# EAGLE design CajitaAbierta (EAGLE 9.6.2)
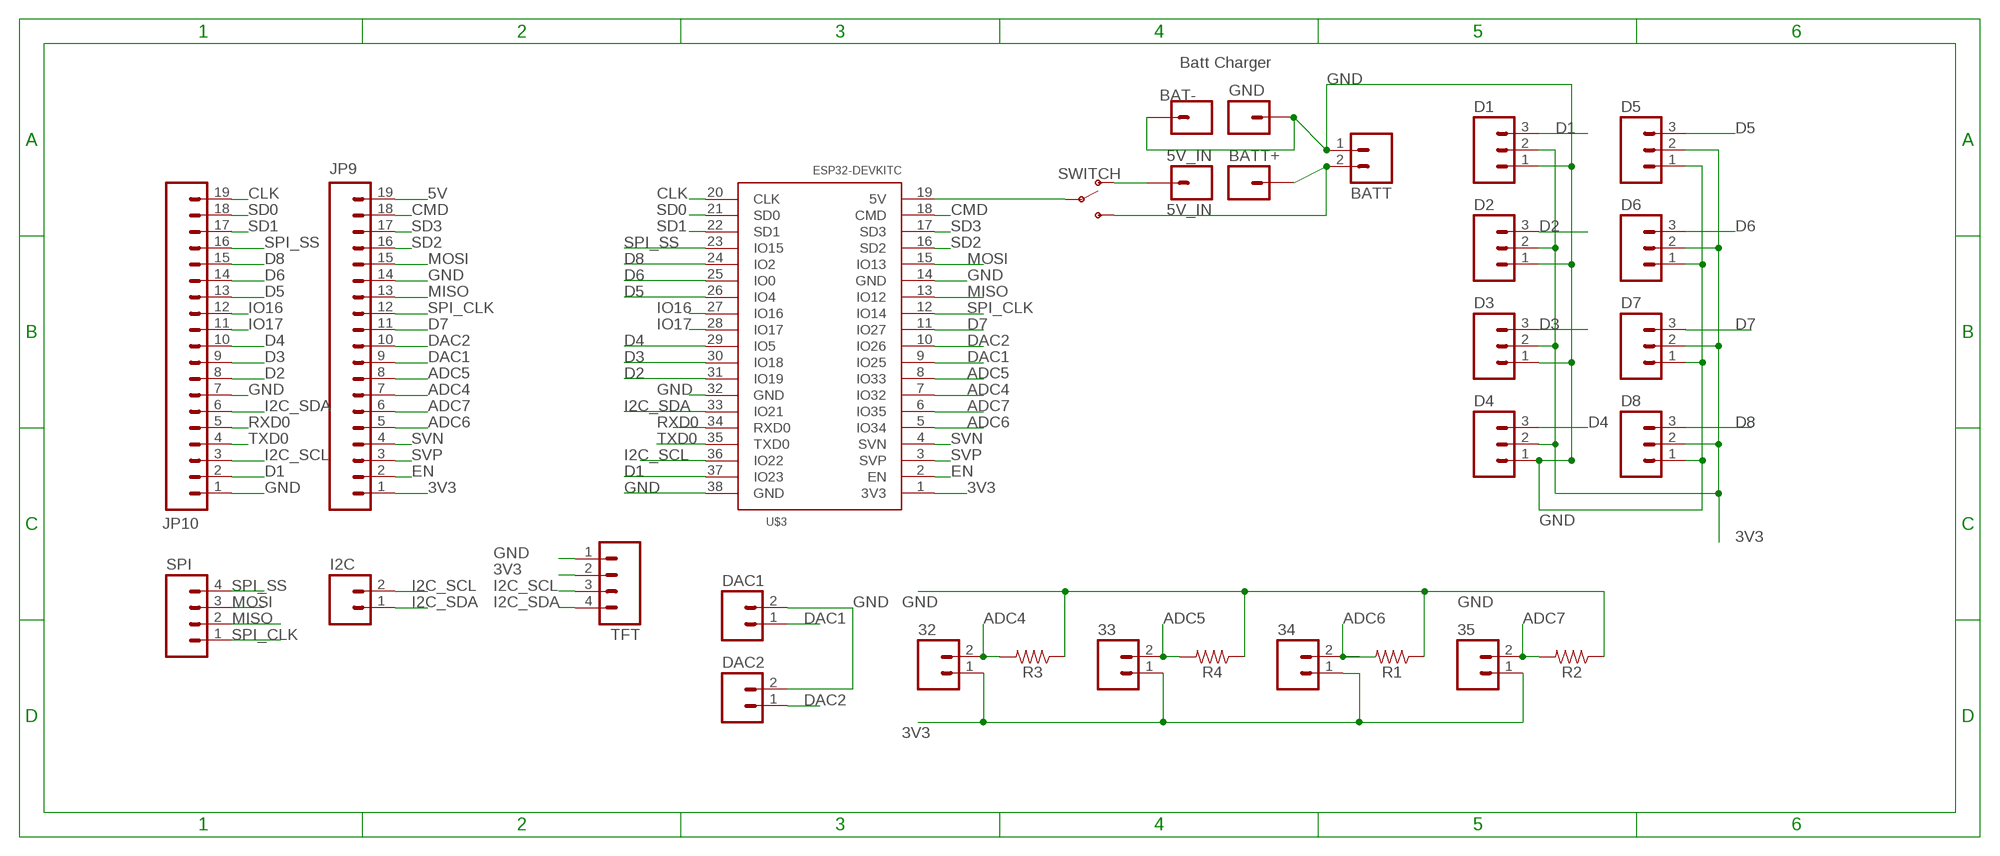
[diagram p0: schematic, sheet 1]

## Parts
5V_IN  5V_IN  M01PTH  [1X01]
32  M02PTH  [1X02]
33  M02PTH  [1X02]
34  M02PTH  [1X02]
35  M02PTH  [1X02]
BAT-  M01PTH  [1X01]
BATT  M02LOCK_LONGPADS  [1X02_LOCK_LONGPADS]
BATT+  M01PTH  [1X01]
D1  M03LOCK_LONGPADS  [1X03_LOCK_LONGPADS]
D2  M03LOCK_LONGPADS  [1X03_LOCK_LONGPADS]
D3  M03LOCK_LONGPADS  [1X03_LOCK_LONGPADS]
D4  M03LOCK_LONGPADS  [1X03_LOCK_LONGPADS]
D5  M03LOCK_LONGPADS  [1X03_LOCK_LONGPADS]
D6  M03LOCK_LONGPADS  [1X03_LOCK_LONGPADS]
D7  M03LOCK_LONGPADS  [1X03_LOCK_LONGPADS]
D8  M03LOCK_LONGPADS  [1X03_LOCK_LONGPADS]
DAC1  M02PTH  [1X02]
DAC2  M02PTH  [1X02]
GND  Batt Charger  M01PTH  [1X01]
I2C  M02PTH  [1X02]
JP9  M191X19  [1X19]
JP10  M191X19  [1X19]
R1  RESISTOR1206  [1206]
R2  RESISTOR1206  [1206]
R3  RESISTOR1206  [1206]
R4  RESISTOR1206  [1206]
SPI  M04PTH  [1X04]
SWITCH  SWITCH-SPDT-SMD-RIGHT-ANGLE  [SWITCH_SPST_SMD_A]
TFT  M04PTH  [1X04]
U$3  ESP32DEVKITC  [ESP32-DEVKITC]

## Nets
3V3: 32.1 33.1 34.1 35.1 D1.2 D2.2 D3.2 D4.2 D5.2 D6.2 D7.2 D8.2 JP9.1 TFT.2 U$3.1(3V3)
5V: JP9.19 SWITCH.2(P) U$3.19(5V)
5V_IN: 5V_IN.1 SWITCH.1(O)
ADC4: 32.2 JP9.7 R3.2 U$3.7(IO32)
ADC5: 33.2 JP9.8 R4.2 U$3.8(IO33)
ADC6: 34.2 JP9.5 R1.2 U$3.5(IO34)
ADC7: 35.2 JP9.6 R2.2 U$3.6(IO35)
BATT+: BATT+.1 BATT.2 SWITCH.3(S)
CLK: JP10.19 U$3.20(CLK)
CMD: JP9.18 U$3.18(CMD)
D1: D1.3 JP10.2 U$3.37(IO23)
D2: D2.3 JP10.8 U$3.31(IO19)
D3: D3.3 JP10.9 U$3.30(IO18)
D4: D4.3 JP10.10 U$3.29(IO5)
D5: D5.3 JP10.13 U$3.26(IO4)
D6: D6.3 JP10.14 U$3.25(IO0)
D7: D7.3 JP9.11 U$3.11(IO27)
D8: D8.3 JP10.15 U$3.24(IO2)
DAC1: DAC1.1 JP9.9 U$3.9(IO25)
DAC2: DAC2.1 JP9.10 U$3.10(IO26)
EN: JP9.2 U$3.2(EN)
GND: BAT-.1 BATT.1 D1.1 D2.1 D3.1 D4.1 D5.1 D6.1 D7.1 D8.1 DAC1.2 DAC2.2 GND.1 JP9.14 JP10.1 JP10.7 R1.1 R2.1 R3.1 R4.1 TFT.1 U$3.14(GND) U$3.32(GND) U$3.38(GND)
I2C_SCL: I2C.2 JP10.3 TFT.3 U$3.36(IO22)
I2C_SDA: I2C.1 JP10.6 TFT.4 U$3.33(IO21)
IO16: JP10.12 U$3.27(IO16)
IO17: JP10.11 U$3.28(IO17)
MISO: JP9.13 SPI.2 U$3.13(IO12)
MOSI: JP9.15 SPI.3 U$3.15(IO13)
RXD0: JP10.5 U$3.34(RXD0)
SD0: JP10.18 U$3.21(SD0)
SD1: JP10.17 U$3.22(SD1)
SD2: JP9.16 U$3.16(SD2)
SD3: JP9.17 U$3.17(SD3)
SPI_CLK: JP9.12 SPI.1 U$3.12(IO14)
SPI_SS: JP10.16 SPI.4 U$3.23(IO15)
SVN: JP9.4 U$3.4(SVN)
SVP: JP9.3 U$3.3(SVP)
TXD0: JP10.4 U$3.35(TXD0)

## Library data of the parts
5V_IN BAT- BATT+ GND = SparkFun-Connectors:M01: Header 1 Standard 1-pin 0.1" header. Use with straight break away headers (SKU : PRT-00116), right angle break away headers (PRT-00553), swiss pins (PRT-00743), machine pins (PRT-00117), and female headers (PRT-00115).
32-35 BATT DAC1 DAC2 I2C = SparkFun-Connectors:M02: Standard 2-pin 0.1" header. Use with - straight break away headers ( PRT-00116) - right angle break away headers (PRT-00553) - swiss pins (PRT-00743) - machine pins (PRT-00117) - female headers (PRT-00115) Molex polarized connector foot print use with: PRT-08233 with associated crimp pins and housings. 2.54_SCREWTERM for use with PRT-10571. 3.5mm Screw Terminal footprints for PRT-08084 5mm Screw Terminal footprints for use with PRT-08432
D1-D8 = SparkFun-Connectors:M03: Header 3 Standard 3-pin 0.1" header. Use with straight break away headers (SKU : PRT-00116), right angle break away headers (PRT-00553), swiss pins (PRT-00743), machine pins (PRT-00117), and female headers (PRT-00115). Molex polarized connector foot print use with SKU : PRT-08232 with associated crimp pins and housings.
JP9 JP10 = SparkFun-Connectors:M19: 1x19 .1" header
R1-R4 = SparkFun-Resistors:RESISTOR: Generic Resistor Package
SPI TFT = SparkFun-Connectors:M04: Header 4 Standard 4-pin 0.1" header. Use with straight break away headers (SKU : PRT-00116), right angle break away headers (PRT-00553), swiss pins (PRT-00743), machine pins (PRT-00117), and female headers (PRT-00115). Molex polarized connector foot print use with SKU : PRT-08231 with associated crimp pins and housings. 1MM SMD Version SKU: PRT-10208
SWITCH = SparkFun-Switches:SWITCH-SPDT: Single Pole, Double Throw (SPDT) Switch Single-pole, double-throw (SPDT) switch. Variant Overview SMD-AYZ0202 Surface Mount DPDT Switch <https://www.sparkfun.com/products/597> (COM-00597) Used on e.g. LilyPad Arduino USB - ATmega32U4 Board <https://www.sparkfun.com/products/12049> PTH-11.6X4.0MM SPDT Mini Power Switch <https://www.sparkfun.com/products/102> (COM-00102) Used on e.g. SparkFun Simon Says - Through-Hole Soldering Kit <https://www.sparkfun.com/products/10547> (KIT-10547) PTH-11.6X4.0MM-KIT KIT version of SPDT Mini Power Switch - Simplifies soldering by removing tStop of switch pins - only one side can be soldered. PTH-11.6X4.0MM-LOCK LOCK version of SPDT Mini Power Switch - Offset pins hold switch in place for easier soldering. SMD-RIGHT-ANGLE Surface Mount Right Angle Switch <https://www.sparkfun.com/products/10860> (COM-10860) Used on e.g. SparkFun ESP8266 Thing <https://www.sparkfun.com/products/13231>; PROD_ID: SWCH-10651; SF_SKU: COM-10860
U$3 = ESP32-DEVKITC:ESP32DEVKITC

## Board
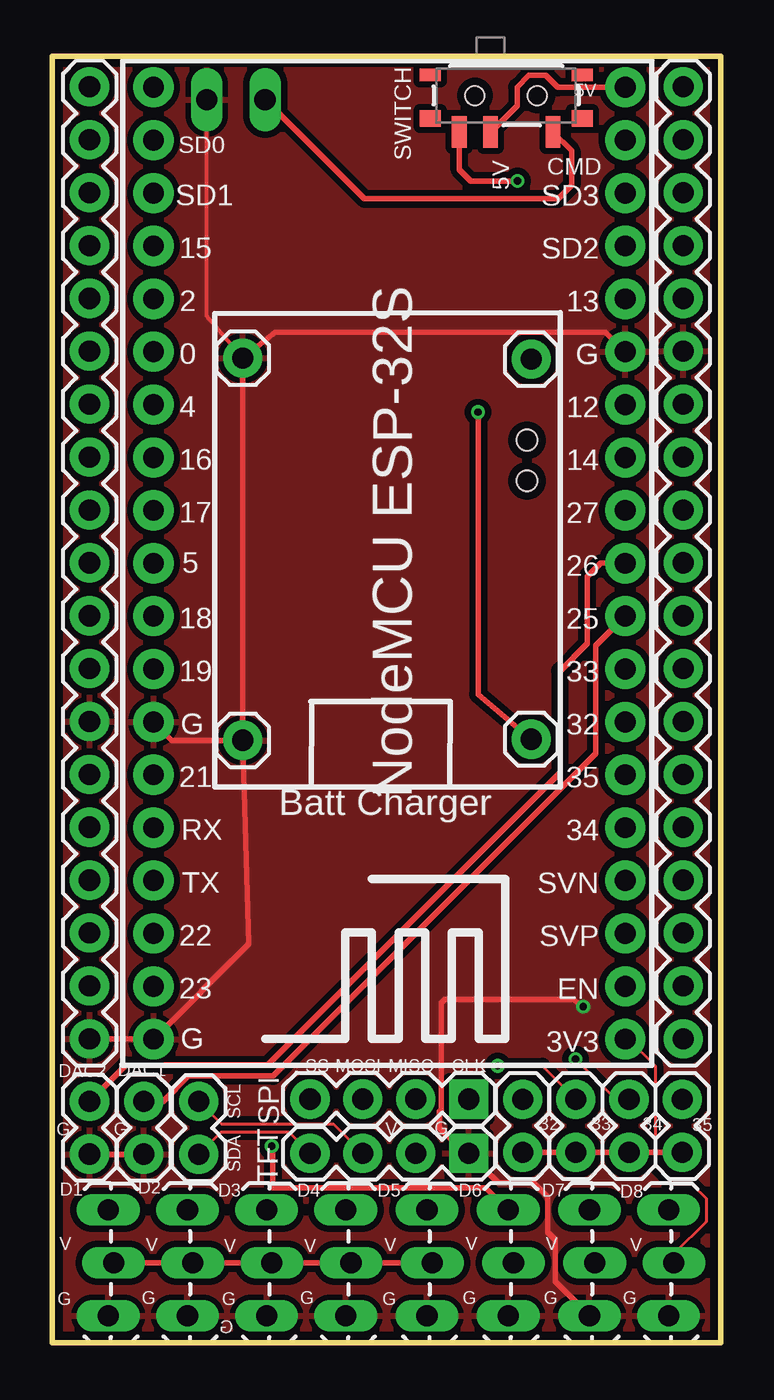
[diagram p1: board, top side]
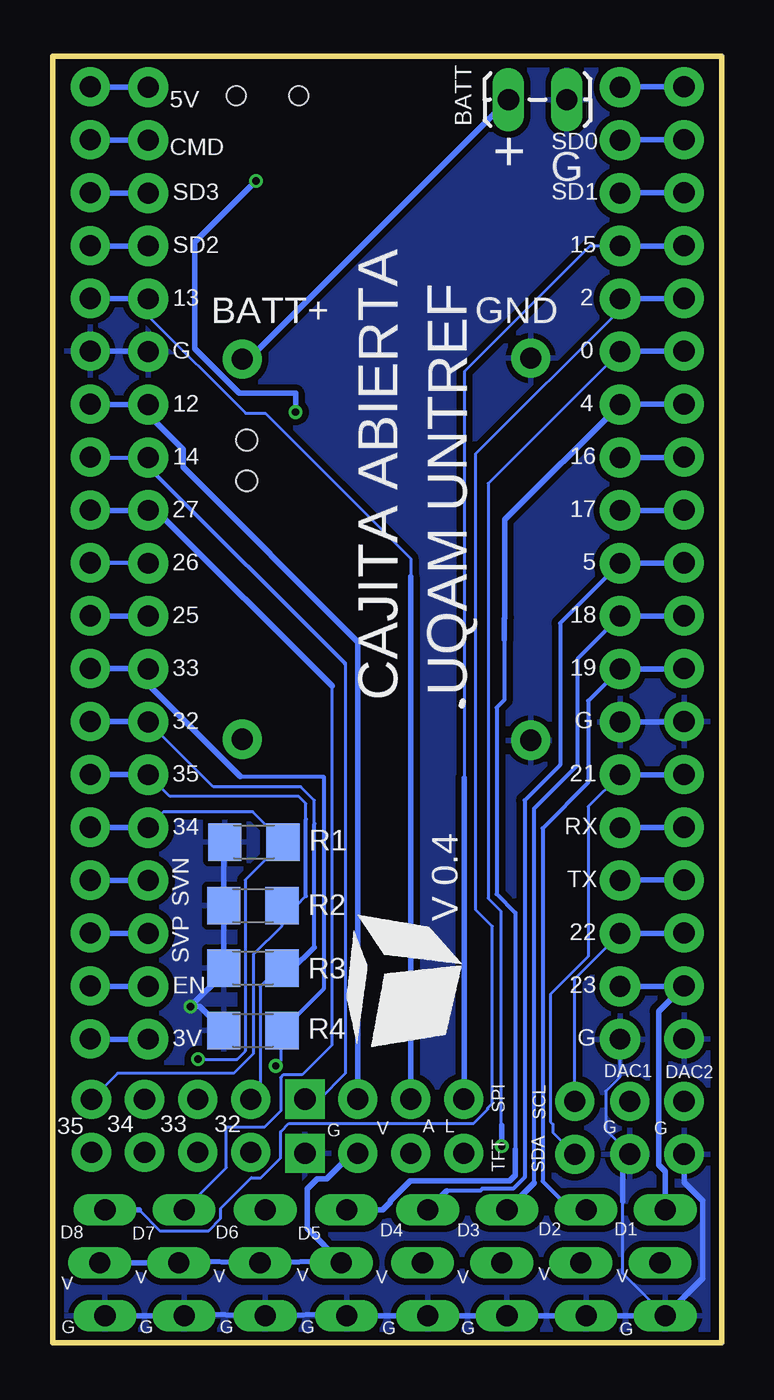
[diagram p2: board, bottom side, seen from below]

Size 32.1 x 61.8 mm. Coordinates in mm from the lower left corner, seen from the top.
Outline: 32.1,61.8 32.1,0 0,0 0,61.8 32.1,61.8
Copper layers (1*16): Top 0.035mm / dielectric 1.5mm / Bottom 0.035mm
Design rules "NOA Eagle Rule 2016-06-12": minimum track width 6mil, minimum drill 0.3mm, track to track 6mil, track to pad 6mil, pad to pad 6mil, via to via 6mil, smd to smd 0mil, copper to edge 0.4mm, drill to drill 10mil, minimum pad ring 10mil, minimum via ring 6mil, stop-mask expansion 2mil, vias tented up to drill 25mil, thermal gap 10mil
Holes 1 mm at 22.8,43.35 22.8,41.4

### Footprints (pad centres in the part's own frame; a part is rotated, then mirrored left to right if it is on the bottom)
1X01 = drill 1.016 pad 1.88: 1 0,0
1X02 = drill 1.016 pad 1.88: 1 0,0; 2 2.54,0
1X02_LOCK_LONGPADS = drill 1.016 long: 1 -0.127,0; 2 2.667,0
1X03_LOCK_LONGPADS = drill 1.016 long: 1 0,0; 2 2.54,-0.254; 3 5.08,0
1X19 = drill 1.016 pad 1.88: 1 0,0; 2 2.54,0; 3 5.08,0; 4 7.62,0; 5 10.16,0; 6 12.7,0; 7 15.24,0; 8 17.78,0; 9 20.32,0; 10 22.86,0; 11 25.4,0; 12 27.94,0; 13 30.48,0; 14 33.02,0; 15 35.56,0; 16 38.1,0; 17 40.64,0; 18 43.18,0; 19 45.72,0
1206 = smd 1.6 x 1.8: 1 -1.4,0; 2 1.4,0
1X04 = drill 1.016 pad 1.88 square: 1 0,0 | drill 1.016 pad 1.88: 2 2.54,0; 3 5.08,0; 4 7.62,0
SWITCH_SPST_SMD_A = smd 0.7 x 1.5: 1 -2.25,-1.75; 2 -0.75,-1.75; 3 2.25,-1.75 | smd 1 x 0.6: GND1 -3.65,1; GND3 3.65,1 | smd 1 x 0.8: GND2 -3.65,-1.1; GND4 3.65,-1.1 | hole 0.9: -1.5,0; 1.5,0
ESP32-DEVKITC = drill 1 pad 1.93: 1 -22.87,-11.42; 2 -20.33,-11.42; 3 -17.79,-11.42; 4 -15.25,-11.42; 5 -12.71,-11.42; 6 -10.17,-11.42; 7 -7.63,-11.42; 8 -5.09,-11.42; 9 -2.55,-11.42; 10 -0.01,-11.42; 11 2.53,-11.42; 12 5.07,-11.42; 13 7.61,-11.42; 14 10.15,-11.42; 15 12.69,-11.42; 16 15.23,-11.42; 17 17.77,-11.42; 18 20.31,-11.42; 19 22.85,-11.42; 20 22.85,11.23; 21 20.31,11.23; 22 17.77,11.23; 23 15.23,11.23; 24 12.69,11.23; 25 10.15,11.23; 26 7.61,11.23; 27 5.07,11.23; 28 2.53,11.23; 29 -0.01,11.23; 30 -2.55,11.23; 31 -5.09,11.23; 32 -7.63,11.23; 33 -10.17,11.23; 34 -12.71,11.23; 35 -15.25,11.23; 36 -17.79,11.23; 37 -20.33,11.23; 38 -22.87,11.23

### Placement (x,y rotation side)
5V_IN  23,28.99 0 top
32  22.6,9.15 90 top
33  25.15,9.15 90 top
34  27.7,9.15 90 top
35  30.25,9.15 90 top
BAT-  9.15,28.94 0 top
BATT  7.56,59.71 180 bottom
BATT+  23,47.24 0 top
D1  2.7,1.3 90 top
D2  6.5,1.3 90 top
D3  10.3,1.3 90 top
D4  14.1,1.3 90 top
D5  18,1.3 90 top
D6  21.9,1.3 90 top
D7  25.8,1.3 90 top
D8  29.6,1.3 90 top
DAC1  4.4,11.6 270 top
DAC2  1.8,11.6 270 top
GND  9.15,47.29 0 top
I2C  7.05,9.05 90 top
JP9  30.3,14.6 90 top
JP10  1.8,14.6 90 top
R1  22.45,24.05 0 bottom
R2  22.5,21 0 bottom
R3  22.5,18 0 bottom
R4  22.5,15 0 bottom
SPI  20,11.7 180 top
SWITCH  21.8,59.9 0 top
TFT  20,9.1 180 top
U$3  16.1,37.45 90 top

### Tracks (layer width: path | path; a pad name or v marks a point on that pad's centre or on a via)
3V3
  Top 0.152: D8.2 29.85,4.27 31.4,5.82 31.4,6.94 30.72,7.62 29.83,7.62 28.95,8.5 28.95,9.2 28.95,13.3 27.67,14.58 U$3.1
  Top 0.254: D1.2 D2.2 D3.2 D4.2 D5.2 | 35.1 29,9.15 28.95,9.2 28.9,9.15 34.1 33.1 32.1
  Bottom 0.152: TFT.2 17.73,9.1
  Bottom 0.254: 17.73,9.1 18.94,7.88 19.42,7.88 19.9,7.4 19.9,5.49 D5.2 18.35,3.94 D6.2 25.95,3.94 D7.2 D8.2 | JP9.1 30.28,14.58 U$3.1
5V
  Top 0.254: U$3.19 24.28,60.3 23.7,60.88 22.89,60.88 22.32,60.3 22.32,59.42 SWITCH.2
  Bottom 0.254: U$3.19 30.28,60.3 JP9.19
5V_IN  (via drill 0.35)
  Top 0.254: v20.45,44.7 20.45,31.14 5V_IN.1 | v22.35,55.8 20.1,55.8 19.55,56.35 SWITCH.1
  Bottom 0.254: v22.35,55.8 25.3,52.85 25.3,47.75 23.15,45.6 20.45,45.6 v20.45,44.7
ADC4
  Bottom 0.152: 21.2,17.9 R3.2 21.26,18 22.15,17.11 22.15,12.14 32.2 | 19.55,24.93 19.55,26.05 20.2,26.7 24.4,26.7 27.54,29.84
  Bottom 0.2: 19.55,19 19.55,24.93
  Bottom 0.254: U$3.7 27.54,29.84 JP9.7 | 19.55,19 20.65,17.9 21.2,17.9
ADC5  (via drill 0.35)
  Top 0.152: v21.4,13.3 23.54,13.3 33.2
  Bottom 0.152: R4.2 21.15,14.95 21.15,13.55 v21.4,13.3
  Bottom 0.2: 23.1,27.19 19.1,27.19 19.1,17 R4.2
  Bottom 0.254: 23.1,27.19 27.52,31.61 U$3.8 27.54,32.38 JP9.8
ADC6  (via drill 0.35)
  Top 0.152: 34.2 27.06,11.69 v25.13,13.62
  Bottom 0.152: v25.13,13.62 23.26,13.62 22.87,14.01 22.87,22.23 R1.2 22.5,25.5 26.8,25.5 27.54,24.76
  Bottom 0.254: U$3.5 27.54,24.76 JP9.5
ADC7
  Bottom 0.152: 19.95,21.45 20.4,21 R2.2 21.1,20.02 22.48,18.64 22.48,13.88 23.41,12.95 28.99,12.95 35.2 | 19.95,25.14 19.95,25.9 20.3,26.25 26.49,26.25 U$3.6
  Bottom 0.2: 19.95,21.45 19.95,25.14
  Bottom 0.254: U$3.6 27.54,27.3 JP9.6
BATT+
  Top 0.254: SWITCH.3 24.95,57.25 24.95,55.59 24.3,54.94 14.99,54.94 BATT.2
  Bottom 0.254: BATT.2 22.7,47.24 BATT+.1
CLK
  Bottom 0.254: JP10.19 4.85,60.32 U$3.20
CMD
  Bottom 0.254: U$3.18 30.28,57.76 JP9.18
D1
  Bottom 0.254: D1.3 2.7,8.24 3.02,8.55 3.02,15.92 JP10.2 1.82,17.12 U$3.37
D2
  Bottom 0.2: D2.3 7.22,6.38 8.59,7.76 8.59,24.71 6.4,26.9 6.4,30.83 U$3.31
  Bottom 0.254: U$3.31 1.82,32.36 JP10.8
D3
  Bottom 0.2: U$3.30 6.9,32.87 6.9,27.75 8.99,25.66 8.99,7.68
  Bottom 0.254: JP10.9 1.82,34.9 U$3.30 | D3.3 8.99,7.68
D4
  Bottom 0.2: 13.18,7.3 11.58,7.3 11.48,7.39 10.01,7.39 9.45,7.95 9.45,26.05 7.75,27.75 7.75,34.56 U$3.29
  Bottom 0.254: U$3.29 1.82,37.44 JP10.10 | 13.18,7.3 D4.3
D5
  Bottom 0.2: 10.42,33.78 10.42,30.88 10.8,30.5 10.8,21.55 9.9,20.65 9.9,9.3
  Bottom 0.254: 10.42,33.78 10.42,34.79 10.4,34.81 10.4,39.53 U$3.26 4.85,45.08 JP10.13 | D5.3 16.26,6.38 15.9,6.74 15.9,6.81 14.94,7.77 10.18,7.77 9.9,8.05 9.9,9.3
D6  (via drill 0.35)
  Top 0.254: D6.3 20.83,7.45 10.6,7.45 10.6,9.4 v10.55,9.45
  Bottom 0.152: U$3.25 11.2,41.27 11.2,21.35 10.6,20.75 10.6,10.5 10.55,10.45
  Bottom 0.254: 10.55,10.45 v10.55,9.45 | JP10.14 4.85,47.62 U$3.25
D7
  Bottom 0.152: 18.7,31.54 18.7,14.3 20.13,12.87 21.03,12.87 21.17,12.73 21.17,11.13 21.95,10.35 23.8,10.35 23.8,8.44 23.77,8.41 D7.3
  Bottom 0.254: JP9.11 30.28,39.98 U$3.11 27.14,39.98 18.7,31.54
D8
  Bottom 0.152: 27.96,6.38 26.97,5.39 24.63,5.39 24.05,5.97 24.05,6.45 22.57,7.93 22.12,7.93 21.17,8.88 21.17,10.13 20.77,10.53 11.9,10.53 11.21,11.22 11.21,11.29 11,11.5 11,20 11.8,20.8 11.8,42.7 4.87,49.63 U$3.24
  Bottom 0.254: U$3.24 1.82,50.14 JP10.15 | D8.3 27.96,6.38
DAC1
  Top 0.254: U$3.9 26.11,33.49 26.11,28.31 10.61,12.81 6.54,12.81 5.34,11.6 DAC1.1
  Bottom 0.254: U$3.9 30.28,34.9 JP9.9
DAC2
  Top 0.2: 24.4,27.4 24.4,32.27
  Top 0.254: 24.4,32.27 25.7,33.58 25.7,36.8 26.34,37.44 U$3.10 | DAC2.1 3.54,13.34 5.39,13.34 5.4,13.35 10.35,13.35 24.4,27.4
  Bottom 0.2: U$3.10 30.28,37.44 JP9.10
EN
  Bottom 0.254: U$3.2 30.28,17.12 JP9.2
GND  (via drill 0.35)
  Top 0.2: GND.1 7.43,49.31 BATT.1
  Top 0.254: DAC2.2 DAC1.2 | U$3.14 26.57,48.55 10.72,48.55 GND.1 BAT-.1 | BAT-.1 5.75,28.94 U$3.32 | JP10.1 4.85,14.6 U$3.38 9.45,19.16 BAT-.1 | D7.1 24.15,2.96 24.15,4.95 23.8,5.3 23.8,7.01 23.14,7.67 21.43,7.67 TFT.1 19.85,9.1 18.6,10.35 18.6,11.12 18.68,11.2 18.68,16.33 18.85,16.5 25.05,16.5 25.3,16.25 25.3,16.15 v25.5,16.15
  Bottom 0.152: D1.1 4.75,3.35 4.75,6.79 | U$3.38 4.87,12.78 5.57,12.08 5.57,10.23 DAC1.2
  Bottom 0.254: D8.1 D7.1 25.7,1.4 D6.1 18.1,1.4 D5.1 D4.1 D3.1 D2.1 D1.1 0.9,3.1 0.9,6.81 1.8,7.71 DAC2.2 | U$3.32 1.82,29.82 JP10.7 | 4.75,6.79 4.75,8.71 DAC1.2 | JP9.14 27.54,47.62 U$3.14 | R4.1 25.05,16.15 v25.5,16.15 23.9,17.75 R3.1 R2.1 23.9,24 R1.1
  pour Top (isolate 0.305): 32.1,0 0,0 0,61.8 32.1,61.8
  pour Bottom (isolate 0.305): 32.1,0 0,0 0,61.8 32.1,61.8
I2C_SCL
  Top 0.152: TFT.3 13.52,10.5 8.14,10.5 I2C.2
  Bottom 0.152: I2C.2 7.05,17.48 U$3.36
  Bottom 0.254: JP10.3 1.82,19.66 U$3.36
I2C_SDA
  Top 0.152: TFT.4 11.38,10.1 8.1,10.1 I2C.1
  Bottom 0.152: I2C.1 8.1,10.1 8.1,10.5 8.22,10.62 8.22,16.74 6.4,18.56 6.4,25.75 U$3.33
  Bottom 0.254: U$3.33 1.82,27.28 JP10.6
IO16
  Bottom 0.254: U$3.27 1.82,42.52 JP10.12
IO17
  Bottom 0.254: U$3.28 1.82,39.98 JP10.11
MISO
  Bottom 0.254: JP9.13 30.28,45.06 U$3.13 27.52,44.57 25.85,42.9 25.85,42.05 17.46,33.66 SPI.2
MOSI
  Bottom 0.152: U$3.15 27.52,49.32 22.85,44.65 21.9,44.65 14.92,37.67 14.92,36.79
  Bottom 0.254: JP9.15 30.28,50.14 U$3.15 27.52,49.39 | 14.92,36.79 SPI.3
RXD0
  Bottom 0.254: U$3.34 1.82,24.74 JP10.5
SD0
  Bottom 0.254: JP10.18 4.85,57.78 U$3.21
SD1
  Bottom 0.254: JP10.17 4.85,55.24 U$3.22
SD2
  Bottom 0.254: U$3.16 30.28,52.68 JP9.16
SD3
  Bottom 0.254: U$3.17 30.28,55.22 JP9.17
SPI_CLK
  Bottom 0.152: SPI.1 19.3,11.7 18.07,12.93 18.07,32.62
  Bottom 0.2: JP9.12 30.28,42.52 U$3.12 27.52,42.07 18.07,32.62
SPI_SS
  Bottom 0.152: U$3.23 6.32,52.68 12.35,46.65 12.35,27.13
  Bottom 0.254: 12.35,27.13 12.35,11.73 SPI.4 | U$3.23 1.82,52.68 JP10.16
SVN
  Bottom 0.254: U$3.4 30.28,22.2 JP9.4
SVP
  Bottom 0.254: U$3.3 30.28,19.66 JP9.3
TXD0
  Bottom 0.254: JP10.4 4.85,22.22 U$3.35

### Text on the board
tNames: 5V | SS | MOSI | MISO | CLK | DAC2 | DAC1 | SCL | G | G | V | G | 34 | SDA | V | V | V | V | V | V | V | V | G | G | G | G | G | G | G | G | G
bNames: G | + | UQAM UNTREF | GND | BATT+ | CAJITA ABIERTA | V 0.4 | DAC2 | DAC1 | SCL | SPI | G | G | SDA | A L | V | G | 32 | 33 | 34 | 35 | TFT | D1 | D2 | D3 | D4 | D5 | D6 | D7 | D8 | V | V | V | V | V | V | V | V | G | G | G | G | G | G | G
uqam: v0.2
noms_b: V+ | 3V3 | G | D4 | D7 | D2 | A0
192bmp: /Users/uqam/Desktop/ohanda_logo.bmp
noms_t: G | DHT11 | D7 | SPKR | 3V | A0 | D2 | G | DEL | V+ | D2 | A0 | D4 | D7 | G | G | V+ | 3V3 | V+ | MQ-7 | V+ | PWR | G
225bmp: /Users/uqam/Documents/AgitPOV_WiFi/logo_texte_gagarin.bmp